# Altium schematic sheet USB_To_JTAG_SPI.SchDoc: USB to JTAG SPI
size A4
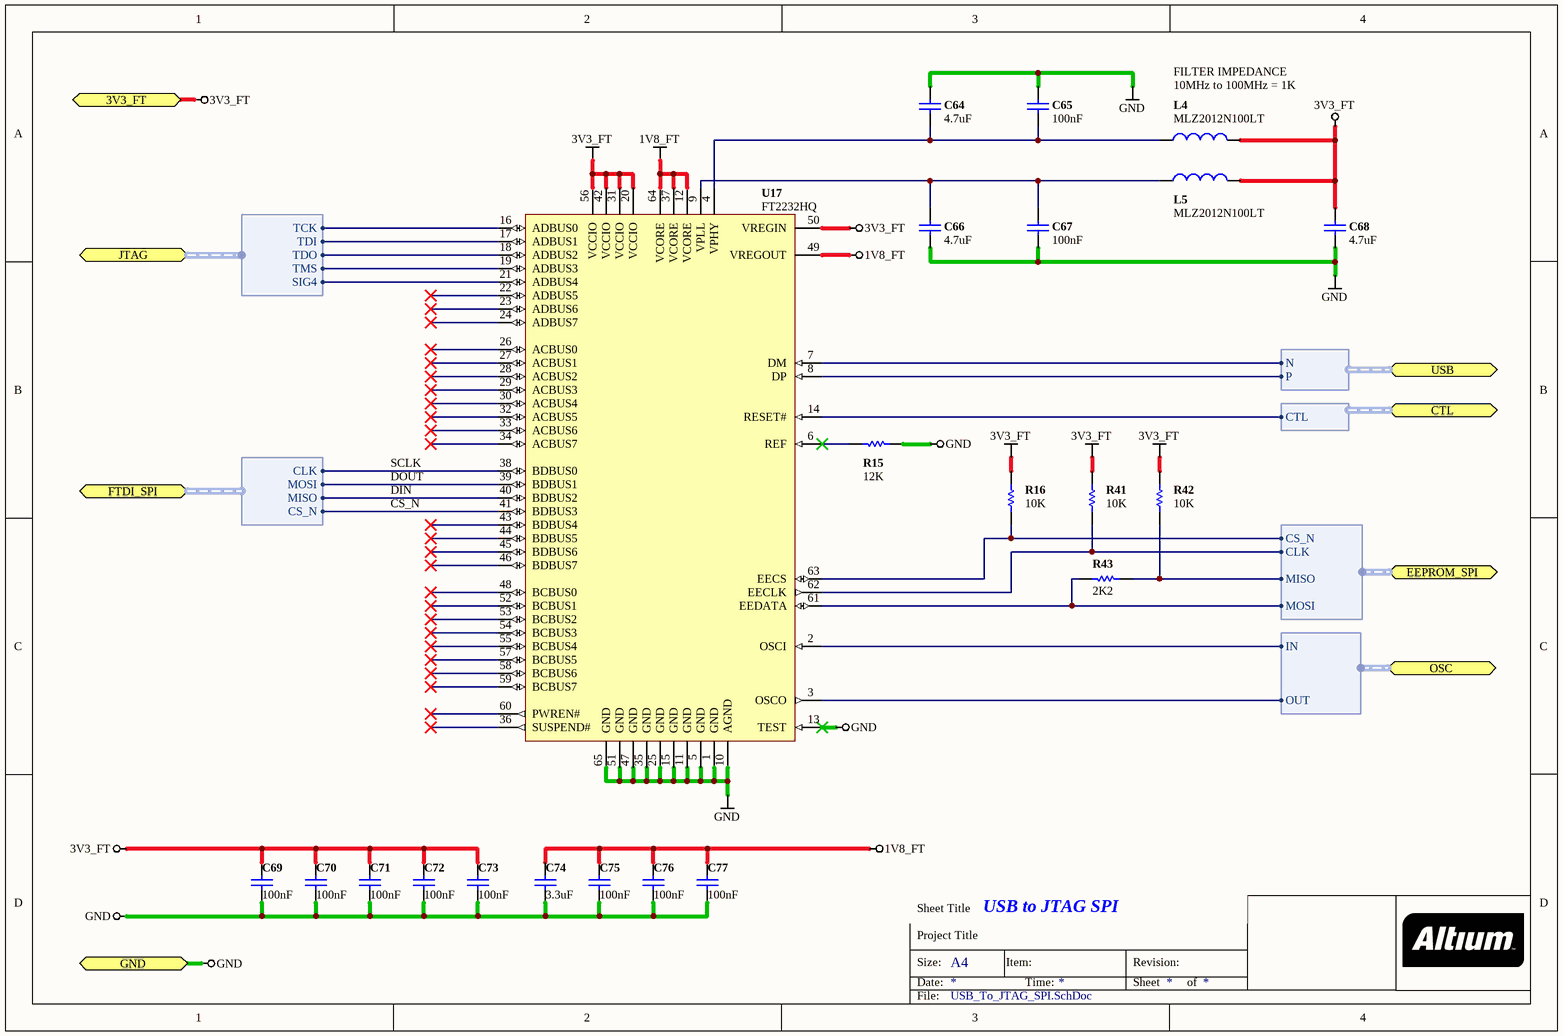
[diagram p0: USB_To_JTAG_SPI.SchDoc]

## Parts
C64  value 4.7uF  [CAPC0402(1005)60_N]  (hidden comment: CAP 4.7uF 6.3V 0402(1005))
C65  value 100nF  [CAPC0402(1005)60_N]  (hidden comment: CAP 100nF 16V 0402(1005))
C66  value 4.7uF  [CAPC0402(1005)60_N]  (hidden comment: CAP 4.7uF 6.3V 0402(1005))
C67  value 100nF  [CAPC0402(1005)60_N]  (hidden comment: CAP 100nF 16V 0402(1005))
C68  value 4.7uF  [CAPC0402(1005)60_N]  (hidden comment: CAP 4.7uF 6.3V 0402(1005))
C69  value 100nF  [CAPC0402(1005)60_N]  (hidden comment: CAP 100nF 16V 0402(1005))
C70  value 100nF  [CAPC0402(1005)60_N]  (hidden comment: CAP 100nF 16V 0402(1005))
C71  value 100nF  [CAPC0402(1005)60_N]  (hidden comment: CAP 100nF 16V 0402(1005))
C72  value 100nF  [CAPC0402(1005)60_N]  (hidden comment: CAP 100nF 16V 0402(1005))
C73  value 100nF  [CAPC0402(1005)60_N]  (hidden comment: CAP 100nF 16V 0402(1005))
C74  value 3.3uF  [CAPC0402(1005)60_N]  (hidden comment: CAP 3.3uF 6.3V 0402(1005))
C75  value 100nF  [CAPC0402(1005)60_N]  (hidden comment: CAP 100nF 16V 0402(1005))
C76  value 100nF  [CAPC0402(1005)60_N]  (hidden comment: CAP 100nF 16V 0402(1005))
C77  value 100nF  [CAPC0402(1005)60_N]  (hidden comment: CAP 100nF 16V 0402(1005))
L4  MLZ2012N100LT  [TDK-0805(2012)125]
L5  MLZ2012N100LT  [TDK-0805(2012)125]
R15  12K  [RESC0402(1005)_N]
R16  10K  [RESC0402(1005)_N]
R41  10K  [RESC0402(1005)_N]
R42  10K  [RESC0402(1005)_N]
R43  2K2  [RESC0402(1005)_N]
U17  FT2232HQ  [QFN64_2_N]

## Ports
3V3_FT, CTL (harness CTL), EEPROM_SPI (harness EEPROM_SPI), FTDI_SPI (harness FTDI_SPI), GND, JTAG (harness JTAG), OSC (harness OSC), USB (harness USB)

## Harnesses
USB: N, P
EEPROM_SPI: CS_N, MISO, MOSI, CLK
OSC: IN, OUT
FTDI_SPI: CLK, CS_N, MOSI, MISO
CTL: CTL
JTAG: TCK, TDI, TDO, TMS, SIG4

## Nets
1V8_FT: C74.2 C75.1 C76.1 C77.1 U17.12(VCORE) U17.37(VCORE) U17.49(VREGOUT) U17.64(VCORE)
3V3_FT: C68.1 C69.1 C70.1 C71.1 C72.1 C73.1 L4.1 L5.1 R16.2 R41.2 R42.2 U17.20(VCCIO) U17.31(VCCIO) U17.42(VCCIO) U17.50(VREGIN) U17.56(VCCIO) ; port 3V3_FT
GND: C64.2 C65.2 C66.1 C67.1 C68.2 C69.2 C70.2 C71.2 C72.2 C73.2 C74.1 C75.2 C76.2 C77.2 R15.2 U17.1(GND) U17.5(GND) U17.10(AGND) U17.11(GND) U17.13(TEST) U17.15(GND) U17.25(GND) U17.35(GND) U17.47(GND) U17.51(GND) U17.65(GND) ; port GND
CS_N: U17.41(BDBUS3) ; port FTDI_SPI.CS_N
DIN: U17.40(BDBUS2) ; port FTDI_SPI.MISO
DOUT: U17.39(BDBUS1) ; port FTDI_SPI.MOSI
SCLK: U17.38(BDBUS0) ; port FTDI_SPI.CLK
NetC64_1: C64.1 C65.1 L4.2 U17.4(VPHY)
NetC66_2: C66.2 C67.2 L5.2 U17.9(VPLL)
NetR15_1: R15.1 U17.6(REF)
NetR16_1: R16.1 U17.63(EECS) ; port EEPROM_SPI.CS_N
NetR41_1: R41.1 U17.62(EECLK) ; port EEPROM_SPI.CLK
NetR42_1: R42.1 R43.1 ; port EEPROM_SPI.MISO
NetR43_2: R43.2 U17.61(EEDATA) ; port EEPROM_SPI.MOSI
NetU17_2: U17.2(OSCI) ; port OSC.IN
NetU17_3: U17.3(OSCO) ; port OSC.OUT
NetU17_7: U17.7(DM) ; port USB.N
NetU17_8: U17.8(DP) ; port USB.P
NetU17_14: U17.14(RESET#) ; port CTL.CTL
NetU17_16: U17.16(ADBUS0) ; port JTAG.TCK
NetU17_17: U17.17(ADBUS1) ; port JTAG.TDI
NetU17_18: U17.18(ADBUS2) ; port JTAG.TDO
NetU17_19: U17.19(ADBUS3) ; port JTAG.TMS
NetU17_21: U17.21(ADBUS4) ; port JTAG.SIG4

Not connected (* = marked no-connect by the designer): U17 22(ADBUS5)* 23(ADBUS6)* 24(ADBUS7)* 26(ACBUS0)* 27(ACBUS1)* 28(ACBUS2)* 29(ACBUS3)* 30(ACBUS4)* 32(ACBUS5)* 33(ACBUS6)* 34(ACBUS7)* 36(SUSPEND#)* 43(BDBUS4)* 44(BDBUS5)* 45(BDBUS6)* 46(BDBUS7)* 48(BCBUS0)* 52(BCBUS1)* 53(BCBUS2)* 54(BCBUS3)* 55(BCBUS4)* 57(BCBUS5)* 58(BCBUS6)* 59(BCBUS7)* 60(PWREN#)*

## Notes on the sheet
- FILTER IMPEDANCE
- (near L4) 10MHz to 100MHz = 1K
- Sheet Title
- Project Title
- Size:
- Date:
- A4
- Item:
- Time:
- Revision:
- Sheet
- of
- File:

## Library data of the parts
C64 C66 C68 = CMP-1034-02137-1: CAP 4.7uF 6.3V ?0% 0402 (1005 Metric) Thickness 0.6mm SMD; Case-Metric: 1005; Case-EIA: 0402; Technology: SMT; Max Thickness: 0.6 mm; Tolerance: ?0%; Rated Voltage: 6.3 V
C65 C67 = CMP-1034-02069-1: CAP 100nF 16V ±10% 0402 (1005 Metric) Thickness 0.6mm SMD; Case-EIA: 0402; Case-Metric: 1005; Max Thickness: 0.6 mm; Tolerance: ±10%; Rated Voltage: 16 V; Technology: SMT
C69-C73 C75-C77 = CMP-1034-02069-1: CAP 100nF 16V ?0% 0402 (1005 Metric) Thickness 0.6mm SMD; Case-EIA: 0402; Case-Metric: 1005; Rated Voltage: 16 V; Max Thickness: 0.6 mm; Tolerance: ?0%; Technology: SMT
C74 = CMP-1034-02132-1: CAP 3.3uF 6.3V ?0% 0402 (1005 Metric) Thickness 0.6mm SMD; Case-Metric: 1005; Case-EIA: 0402; Max Thickness: 0.6 mm; Tolerance: ?0%; Rated Voltage: 6.3 V; Technology: SMT
L4 L5 = CMP-5175-00000-1: Multilayer Inductor, 10 uH, ?0%, 300 mOhm, 50MHz, 0805(2012); DC Resistance: 0.30 Ohm; Class: Passive; IEC-class: Fixed inductor; Sub-class: Inductor
R15 = CMP-1011-00100-1: 12K 0.063W 5% 0402 (1005 Metric)  SMD; Value: 12000.00 Ohm; Case-Metric: 1005; Case-EIA: 0402; Tolerance: 5 %; Power: 0.063 W; Technology: SMT
R16 R41 R42 = CMP-1011-00098-1: 10K 0.063W 5% 0402 (1005 Metric)  SMD; Case-EIA: 0402; Case-Metric: 1005; Value: 10000.00 Ohm; Tolerance: 5 %; Power: 0.063 W; Technology: SMT
R43 = CMP-1011-00082-1: 2K2 0.063W 5% 0402 (1005 Metric)  SMD; Value: 2200.00 Ohm; Case-EIA: 0402; Case-Metric: 1005; Tolerance: 5 %; Power: 0.063 W; Technology: SMT
U17 = CMP-0078-00003-2: Dual High Speed USB To Multipurpose UART/FIFO IC, QFN-64, Tray; DatasheetVersion: ver 2.10, Nov-2010; ComponentLink1Description: Manufacturer URL; PackageVersion: 2010; ComponentLink1URL: http://www.ftdichip.com/; PackageReference: QFN64_2; PackageDescription: 64-Pin Quad Flat No-Lead, 9 x 9 mm Body, 0.5 mm Pitch, 4.35 x 4.35 mm Exposed Pad; RevisionNote: URLs added.; ComponentLink2URL: http://www.ftdichip.com/Support/Documents/DataSheets/ICs/DS_FT2232H.pdf; ComponentLink2Description: Datasheet